# Altium schematic sheet ETHERNET.SchDoc
size B; SheetNumber: 3; SheetTotal: 4
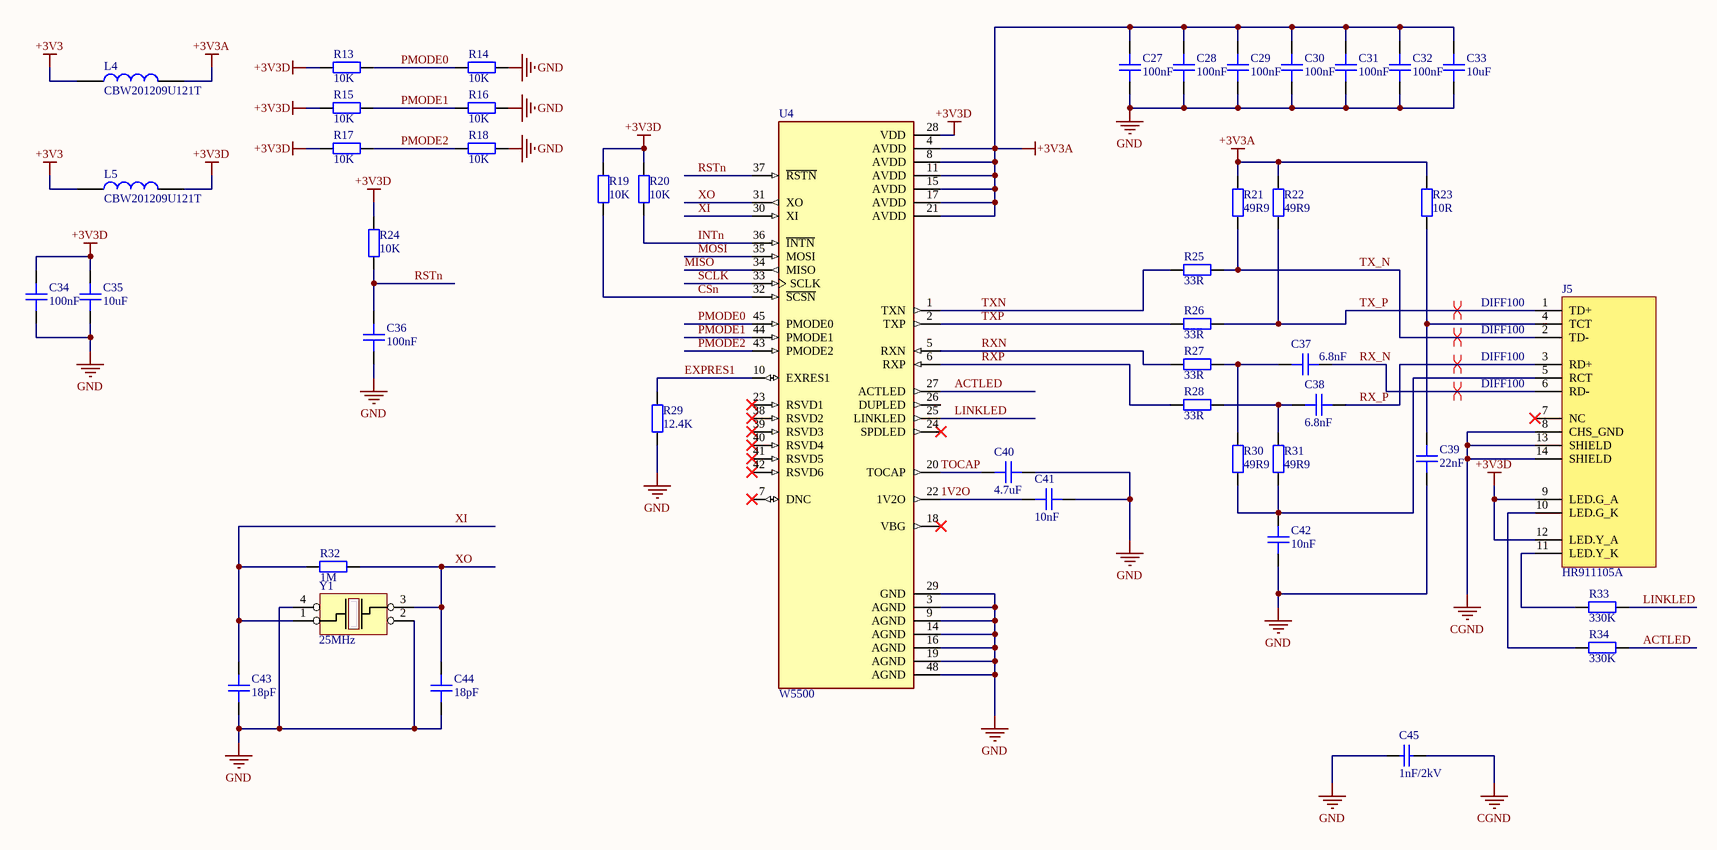
[diagram p0: ETHERNET.SchDoc]

## Parts
C27  100nF  [CAPC-0603 (1608)]
C28  100nF  [CAPC-0603 (1608)]
C29  100nF  [CAPC-0603 (1608)]
C30  100nF  [CAPC-0603 (1608)]
C31  100nF  [CAPC-0603 (1608)]
C32  100nF  [CAPC-0603 (1608)]
C33  10uF  [CAPC-0603 (1608)]
C34  100nF  [CAPC-0603 (1608)]
C35  10uF  [CAPC-0603 (1608)]
C36  100nF  [CAPC-0603 (1608)]
C37  6.8nF  [CAPC-0603 (1608)]
C38  6.8nF  [CAPC-0603 (1608)]
C39  22nF  [CAPC-0603 (1608)]
C40  4.7uF  [CAPC-0603 (1608)]
C41  10nF  [CAPC-0603 (1608)]
C42  10nF  [CAPC-0603 (1608)]
C43  18pF  [CAPC-0603 (1608)]
C44  18pF  [CAPC-0603 (1608)]
C45  1nF/2kV  [tu 1206]
J5  HR911105A  [HR911105A]
L4  CBW201209U121T  [IND-0805 (2012)]
L5  CBW201209U121T  [IND-0805 (2012)]
R13  10K  [RESC-0603 (1608)]
R14  10K  [RESC-0603 (1608)]
R15  10K  [RESC-0603 (1608)]
R16  10K  [RESC-0603 (1608)]
R17  10K  [RESC-0603 (1608)]
R18  10K  [RESC-0603 (1608)]
R19  10K  [RESC-0603 (1608)]
R20  10K  [RESC-0603 (1608)]
R21  49R9  [RESC-0603 (1608)]
R22  49R9  [RESC-0603 (1608)]
R23  10R  [RESC-0603 (1608)]
R24  10K  [RESC-0603 (1608)]
R25  33R  [RESC-0603 (1608)]
R26  33R  [RESC-0603 (1608)]
R27  33R  [RESC-0603 (1608)]
R28  33R  [RESC-0603 (1608)]
R29  12.4K  [RESC-0603 (1608)]
R30  49R9  [RESC-0603 (1608)]
R31  49R9  [RESC-0603 (1608)]
R32  1M  [RESC-0603 (1608)]
R33  330K  [RESC-0603 (1608)]
R34  330K  [RESC-0603 (1608)]
U4  W5500  [QFP50P900X900X160-48N]
Y1  25MHz  [CRYSTALL_SMD_3225]

## Nets
+3V3: L4.2 L5.1
+3V3A: C27.2 C28.2 C29.2 C30.2 C31.2 C32.2 C33.2 L4.1 R21.2 R22.2 R23.2 U4.4(AVDD) U4.8(AVDD) U4.11(AVDD) U4.15(AVDD) U4.17(AVDD) U4.21(AVDD)
+3V3D: C34.2 C35.2 J5.9(LED.G_A) J5.12(LED.Y_A) L5.2 R13.1 R15.1 R17.1 R19.2 R20.2 R24.2 U4.28(VDD)
CGND: C45.1 J5.8(CHS_GND) J5.13(SHIELD) J5.14(SHIELD)
GND: C27.1 C28.1 C29.1 C30.1 C31.1 C32.1 C33.1 C34.1 C35.1 C36.1 C39.1 C40.2 C41.2 C42.1 C43.1 C44.1 C45.2 R14.2 R16.2 R18.2 R29.1 U4.3(AGND) U4.9(AGND) U4.14(AGND) U4.16(AGND) U4.19(AGND) U4.29(GND) U4.48(AGND) Y1.2 Y1.4
1V2O: C41.1 U4.22(1V2O)
ACTLED: R34.2 U4.27(ACTLED)
CSn: R19.1 U4.32(~{SCSN})
EXPRES1: R29.2 U4.10(EXRES1)
INTn: R20.1 U4.36(~{INTN})
LINKLED: R33.2 U4.25(LINKLED)
MISO: U4.34(MISO)
MOSI: U4.35(MOSI)
PMODE0: R13.2 R14.1 U4.45(PMODE0)
PMODE1: R15.2 R16.1 U4.44(PMODE1)
PMODE2: R17.2 R18.1 U4.43(PMODE2)
RSTn: C36.2 R24.1 U4.37(~{RSTN})
RX_N: C37.2 J5.6(RD-)
RX_P: C38.2 J5.3(RD+)
RXN: R27.1 U4.5(RXN)
RXP: R28.1 U4.6(RXP)
SCLK: U4.33(SCLK)
TOCAP: C40.1 U4.20(TOCAP)
TX_N: J5.2(TD-) R21.1 R25.2
TX_P: J5.1(TD+) R22.1 R26.2
TXN: R25.1 U4.1(TXN)
TXP: R26.1 U4.2(TXP)
XI: C43.2 R32.1 U4.30(XI) Y1.1
XO: C44.2 R32.2 U4.31(XO) Y1.3
NetC37_1: C37.1 R27.2 R30.2
NetC38_1: C38.1 R28.2 R31.2
NetC39_2: C39.2 J5.4(TCT) R23.1
NetC42_2: C42.2 J5.5(RCT) R30.1 R31.1
NetJ5_10: J5.10(LED.G_K) R34.1
NetJ5_11: J5.11(LED.Y_K) R33.1

Not connected (* = marked no-connect by the designer): J5 7(NC)*; U4 7(DNC)* 18(VBG)* 23(RSVD1)* 24(SPDLED)* 26(DUPLED) 38(RSVD2)* 39(RSVD3)* 40(RSVD4)* 41(RSVD5)* 42(RSVD6)*

## Layout directives
differential pair; net class DIFF100: TX_N
differential pair; differential pair class DIFF100: RX_N, RX_P, TX_P

## Library data of the parts
C27-C32 C34 C36 = CC0603KRX7R7BB105: CAP CER 1uF 10% 16V X7R 0603; Value: 105/16V; CompanyID: VT-00017; Solder: SMT; MPN: CC0603KRX7R7BB105; Category: CAPACITOR; PinCount: 2
C33 C35 = CC0603JRX7R9BB183: CAP CER 0.018UF 50V X7R 0603; MFR: Yageo; Value: 183/50V; Solder: SMT; MPN: CC0603JRX7R9BB183; Category: CAPACITOR; PinCount: 2
C37 C38 = CC0603JRX7R9BB682: CAP CER 6.8nF 5% 50V X7R 0603; CompanyID: VT-00669; Solder: SMT; Value: 682/50V; MPN: CC0603JRX7R9BB682; Category: CAPACITOR; PinCount: 2
C39 = CC0603KRX7R7BB224: CAP CER 0.22UF 16V X7R 0603; MFR: Yageo; Value: 224/16V; Solder: SMT; MPN: CC0603KRX7R7BB224; Category: CAPACITOR; PinCount: 2
C40 = CC0603JRNPO9BN471: CAP CER 470pF 50V 5% C0G/NPO 0603; Value: 471/50V; Solder: SMT; CompanyID: VT-01332; MPN: CC0603JRNPO9BN471; Category: CAPACITOR; PinCount: 2
C41 C42 = CC0603KRX7R7BB103: CAP CER 10nF 16V 10% X7R 0603; CompanyID: VT-00592; Solder: SMT; Value: 103/16V; MPN: CC0603KRX7R7BB103; Category: CAPACITOR; PinCount: 2
C43 C44 = CC0603JRNPO9BN181: CAP CER 180PF 50V 5% COG/NPO 0603; Solder: SMT; CompanyID: VT-01337; Value: 181/50V; MPN: CC0603JRNPO9BN181; Category: CAPACITOR; PinCount: 2
C45 = Tu 1206 470pF 50V 10%: Dán; Don_Vi: Con; So_Chan: 2; Ten_Linh_Kien: Tụ 1206 470P 10% 50V; Ma_Hang: MH004548; Chung_Loai: Dán; Kieu_Chan: *
J5 = HR911105A: Hanrun HR911105A RJ-45 Connector; Solder: WAVE; MPN: HR911105A; MFR: HanRun; Value: HR911105A
L4 L5 = MPZ2012S221A: IND-FERRITE BEAD 220 OHM 0805 1LN; CompanyID: VT-00253; Solder: SMT; Value: 220OHM/3A; MPN: MPZ2012S221A; Category: FERRITE BEAD; PinCount: 2
R13-R20 R24 = RC0603FR-0710KL: RES SMD 10K OHM 1% 1/10W 0603; CompanyID: VT-00328; Solder: SMT; MPN: RC0603FR-0710KL; Value: 10K; Category: RESISTOR
R21 R22 R30 R31 = RC0603FR-0749R9L: RES SMD 49.9 OHM 1% 1/10W 0603; MFR: Yageo; Solder: SMT; MPN: RC0603FR-0749R9L; Value: 49R9; Category: RESISTOR; PinCount: 2
R23 = RC0603FR-0710RL: RES SMD 10 OHM 1% 1/10W 0603; CompanyID: VT-00865; Solder: SMT; MPN: RC0603FR-0710RL; Value: 10R; Category: RESISTOR
R25-R28 = RC0603FR-0733RL: RES SMD 33 OHM 1% 1/10W 0603; MFR: Yageo; Solder: SMT; MPN: RC0603FR-0733RL; Value: 33R; Category: RESISTOR
R29 = RC0603FR-0712KL: RES SMD 12KOHM 1% 1/10W 0603; Solder: SMT; Value: 12K; CompanyID: *; MPN: RC0603FR-0712KL; Category: RESISTOR
R32 = RC0603FR-0710ML: RES SMD 10M OHM 1% 1/10W 0603; Solder: SMT; MPN: RC0603FR-0710ML; Value: 10M; Category: RESISTOR
R33 R34 = RC0603FR-07330KL: RES SMD 330K OHM 1% 1/10W 0603; Solder: SMT; CompanyID: VT-01025; MPN: RC0603FR-07330KL; Value: 330K; Category: RESISTOR
U4 = W5500: Hardwired TCP/IP embedded Ethernet controller; Availability: Unavailable; MP: W5500; Value: *; Price: None; Package: None
Y1 = ABM8G-25.000MHZ-18-D2Y-T: CRYSTAL 25.0000MHZ 18PF SMD; MFR: Abracon LLC; Solder: SMT; CompanyID: VT-xxx; MPN: ABM8G-25.000MHZ-18-D2Y-T; Value: 25MHz; Category: CRYSTAL